# EAGLE design statim board2 (EAGLE 9.5.2)
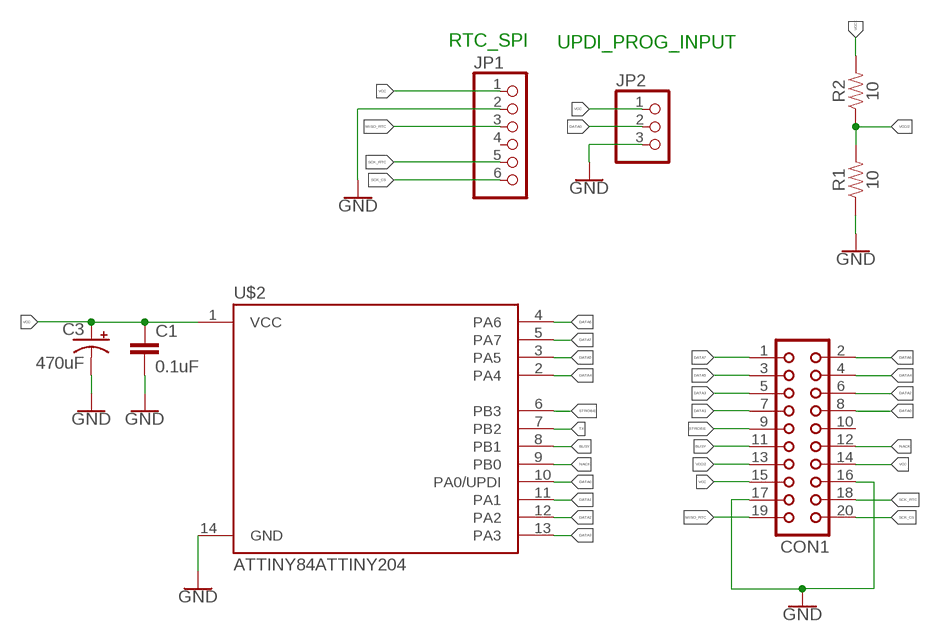
[diagram p0: schematic, sheet 1]

## Parts
C1  0.1uF  1.0UF-1206-50V-10%  [1206]
C3  470uF  560UF-PANASONIC_G-25V-20%  [PANASONIC_G]
CON1  CON20  [CON20]
JP1  PINHD-1X6  [1X06]
JP2  PINHD-1X3  [1X03]
R1  10  10OHM-1206-1/4W-1%  [1206]
R2  10  10OHM-1206-1/4W-1%  [1206]
U$2  ATTINY84ATTINY204  [SO14]

## Nets
BUSY: CON1.11 U$2.8(PB1)
DATA0: CON1.8 JP2.2 U$2.10(PA0/UPDI)
DATA1: CON1.7 U$2.11(PA1)
DATA2: CON1.6 U$2.12(PA2)
DATA3: CON1.5 U$2.13(PA3)
DATA4: CON1.4 U$2.2(PA4)
DATA5: CON1.3 U$2.3(PA5)
DATA6: CON1.2 U$2.4(PA6)
DATA7: CON1.1 U$2.5(PA7)
GND: C1.2 C3.- CON1.16 CON1.17 JP1.2 JP2.3 R1.1 U$2.14(GND)
MISO_RTC: CON1.19 JP1.3
NACK: CON1.12 U$2.9(PB0)
SCK_CS: CON1.20 JP1.6
SCK_RTC: CON1.18 JP1.5
STROBE: CON1.9 U$2.6(PB3)
TX: U$2.7(PB2)
VCC: C1.1 C3.+ CON1.14 CON1.15 JP1.1 JP2.1 R2.2 U$2.1(VCC)
VCC/2: CON1.13 R1.2 R2.1
Unconnected: CON1.10 JP1.4

## Notes on the sheet
- RTC_SPI | UPDI_PROG_INPUT

## Library data of the parts
C1 = SparkFun-Capacitors:1.0UF: 1µF ceramic capacitors A capacitor is a passive two-terminal electrical component used to store electrical energy temporarily in an electric field.; PROD_ID: CAP-09822; VALUE: 1.0uF
C3 = SparkFun-Capacitors:560UF: 560µF polarized capacitors A capacitor is a passive two-terminal electrical component used to store electrical energy temporarily in an electric field.; PROD_ID: CAP-09983; VALUE: 560uF
CON1 = con-harting:CON20: CONNECTOR; OC_FARNELL: unknown; OC_NEWARK: unknown
JP1 = adafruit:PINHD-1X6: PIN HEADER
JP2 = adafruit:PINHD-1X3: PIN HEADER
R1 R2 = SparkFun-Resistors:10OHM: 10Ω resistor A resistor is a passive two-terminal electrical component that implements electrical resistance as a circuit element. Resistors act to reduce current flow, and, at the same time, act to lower voltage levels within circuits. - Wikipedia; PROD_ID: RES-08705
U$2 = ATTINY204:ATTINY84: Atmel 14-pin 2/4/8kB flash uC Datasheet <https://cdn.sparkfun.com/datasheets/Widgets/doc8006.pdf> SparkFun Products Tiny AVR Programmer <https://www.sparkfun.com/products/11801> (PGM-11801) SparkFun Servo Trigger - Continuous Rotation <https://www.sparkfun.com/products/13872> (WIG-13872) SparkFun Servo Trigger <https://www.sparkfun.com/products/13118> (WIG-13118)

## Board
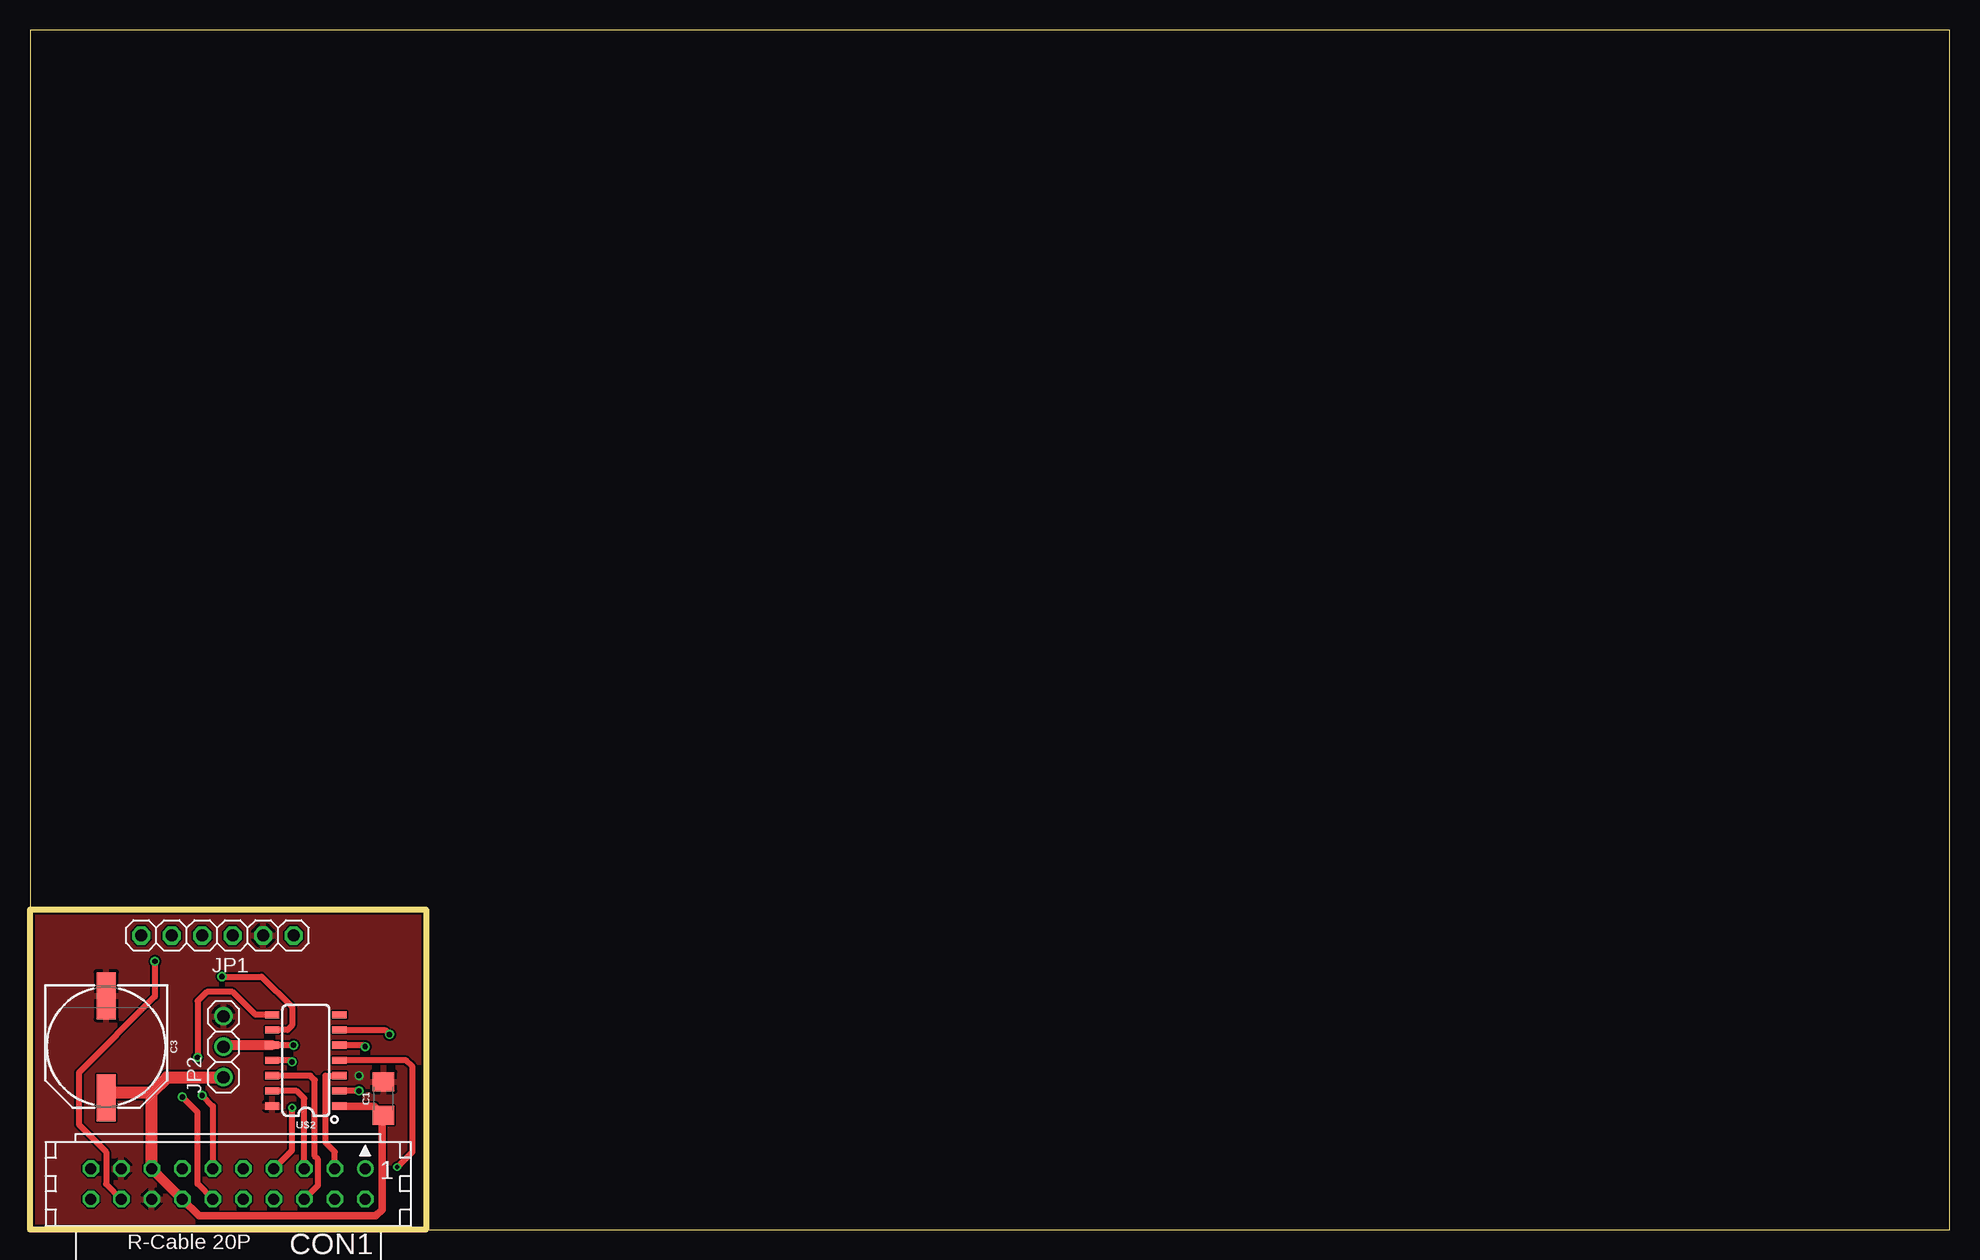
[diagram p1: board, top side]
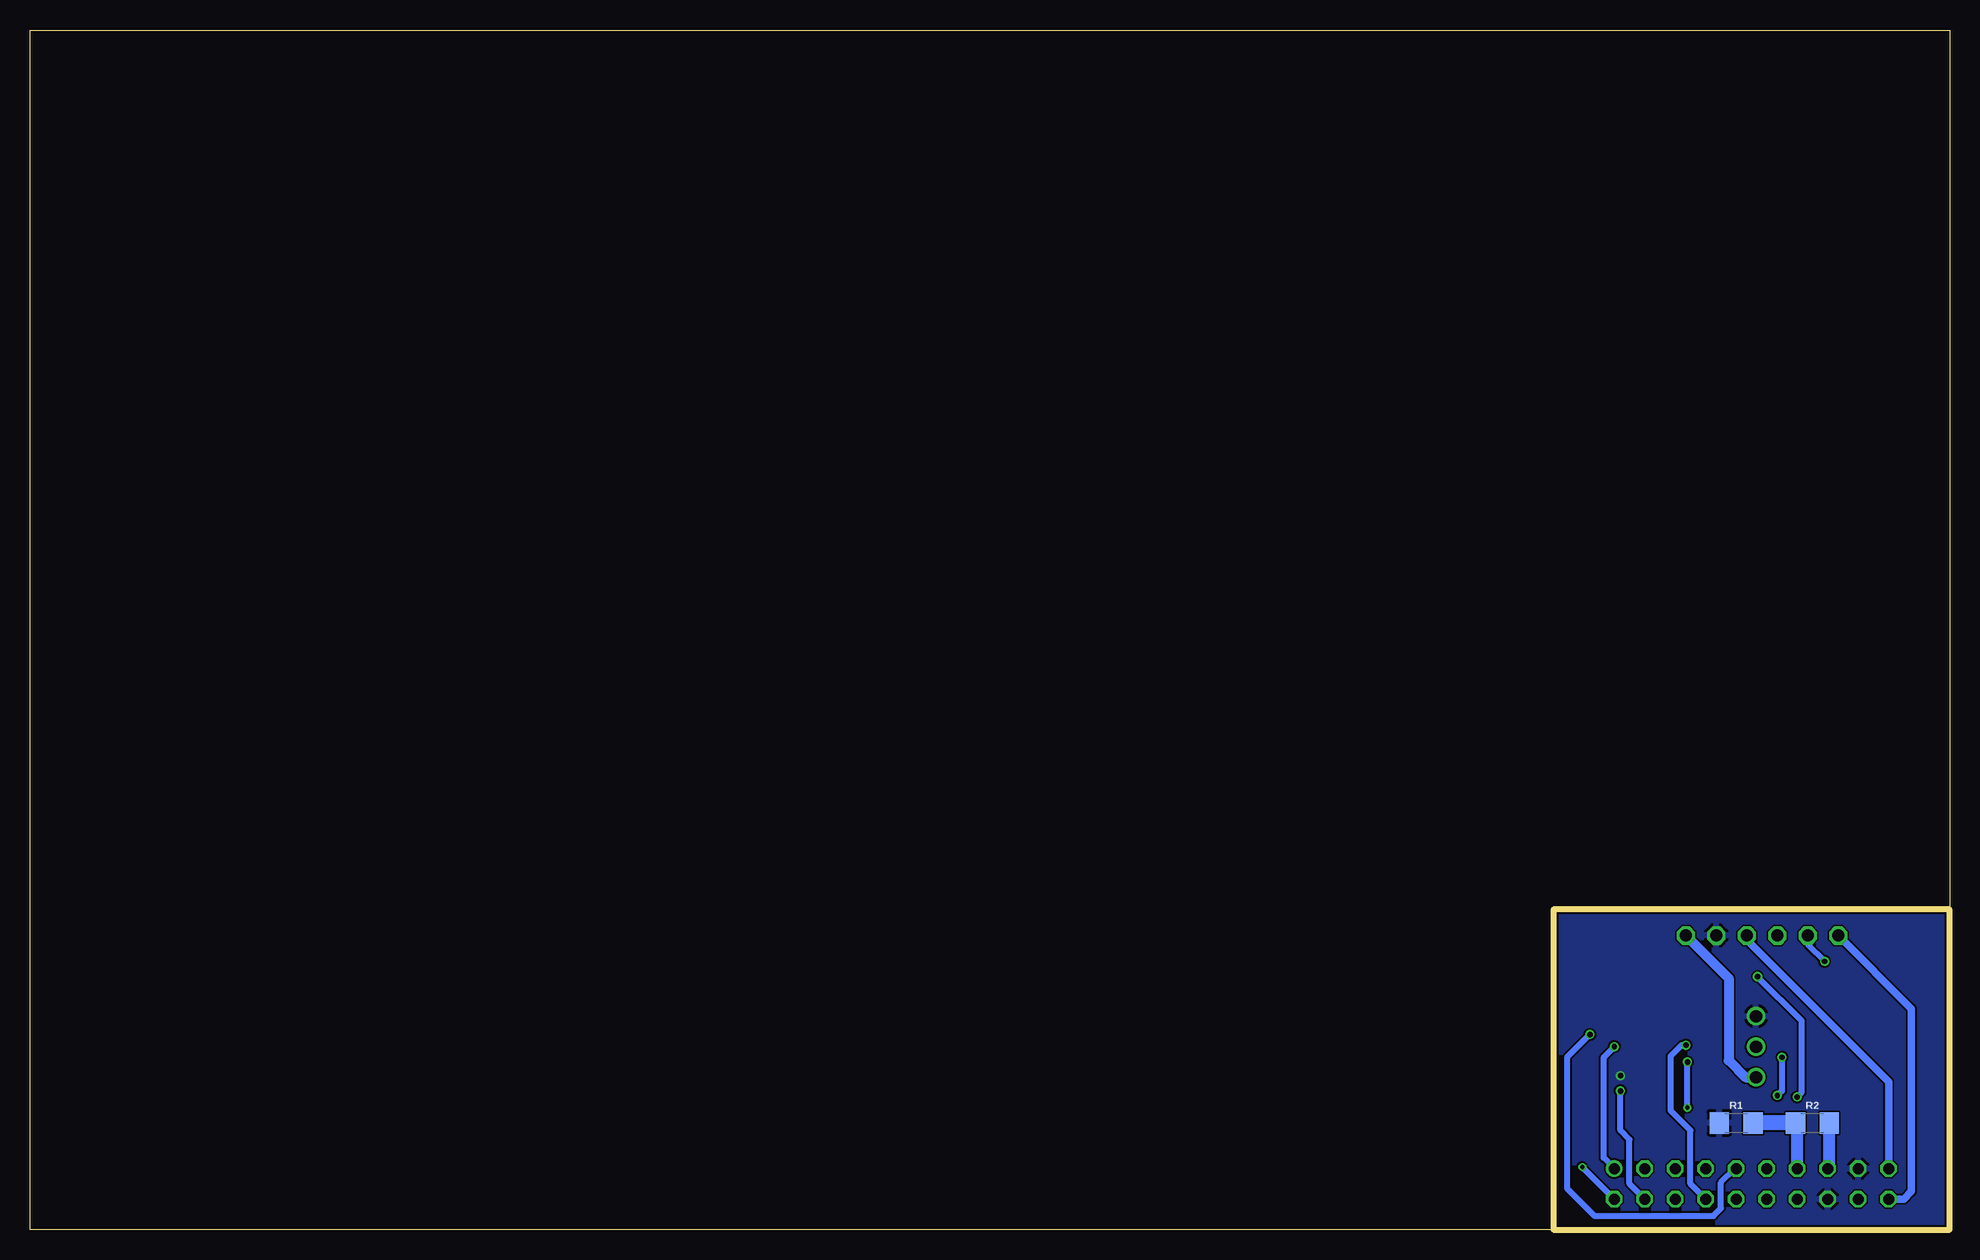
[diagram p2: board, bottom side, seen from below]

Size 160 x 100 mm. Coordinates in mm from the lower left corner, seen from the top.
Outline: 33.02,0 160,0 160,100 0,100 0,26.67
Outline: 0,26.67 0,0 33.02,0
Outline: 0,26.67 33.02,26.67 33.02,0
Copper layers (1*16): Top 0.035mm / dielectric 1.5mm / Bottom 0.035mm
Design rules "SparkFun-2-layer-PCBWay-LIMIT": minimum track width 6mil, minimum drill 0.3mm, track to track 6mil, track to pad 6mil, pad to pad 6mil, via to via 6mil, smd to smd 6mil, copper to edge 6mil, drill to drill 6mil, minimum pad ring 6mil, minimum via ring 6mil, stop-mask expansion 4mil, vias tented up to drill 25mil, thermal gap 10mil

### Footprints (pad centres in the part's own frame; a part is rotated, then mirrored left to right if it is on the bottom)
1206 = smd 1.6 x 1.8: 1 -1.4,0; 2 1.4,0
PANASONIC_G = smd 3.9 x 1.6: + 4.25,0; - -4.25,0
CON20 = drill 0.914: 1 -11.43,-1.27 | drill 0.914 octagon: 2 -11.43,1.27; 3 -8.89,-1.27; 4 -8.89,1.27; 5 -6.35,-1.27; 6 -6.35,1.27; 7 -3.81,-1.27; 8 -3.81,1.27; 9 -1.27,-1.27; 10 -1.27,1.27; 11 1.27,-1.27; 12 1.27,1.27; 13 3.81,-1.27; 14 3.81,1.27; 15 6.35,-1.27; 16 6.35,1.27; 17 8.89,-1.27; 18 8.89,1.27; 19 11.43,-1.27; 20 11.43,1.27
1X06 = drill 1.016 octagon: 1 -6.35,0; 2 -3.81,0; 3 -1.27,0; 4 1.27,0; 5 3.81,0; 6 6.35,0
1X03 = drill 1.016: 1 -2.54,0; 2 0,0; 3 2.54,0
SO14 = smd 0.6 x 1.2: 1 -3.175,-2.8; 2 -1.905,-2.8; 3 -0.635,-2.8; 4 0.635,-2.8; 5 1.905,-2.8; 6 3.175,-2.8; 7 4.445,-2.8; 8 4.445,2.8; 9 3.175,2.8; 10 1.905,2.8; 11 0.635,2.8; 12 -0.635,2.8; 13 -1.905,2.8; 14 -3.175,2.8

### Placement (x,y rotation side)
C1  29.46,10.92 90 top
C3  6.35,15.24 270 top
CON1  16.51,3.81 180 top
JP1  15.62,24.51 180 top
JP2  16.13,15.24 90 top
R1  17.78,8.89 0 bottom
R2  11.43,8.89 0 bottom
U$2  22.99,13.46 90 top

### Tracks (layer width: path | path; a pad name or v marks a point on that pad's centre or on a via)
BUSY  (via drill 0.45)
  Top 0.508: v13.97,14.35 13.97,19.05 14.73,19.81 16.89,19.81 18.8,17.91 U$2.8 | v14.35,11.18 15.24,10.29 CON1.11
  Bottom 0.508: v13.97,14.35 13.97,11.56 v14.35,11.18
DATA0  (via drill 0.45)
  Top 0.508: v21.97,15.37 U$2.10
  Top 0.813: U$2.10 16.26,15.37 JP2.2
  Bottom 0.508: CON1.8 21.59,3.81 21.59,8.26 23.24,9.91 23.24,14.48 22.35,15.37 v21.97,15.37
DATA1  (via drill 0.35, 0.45)
  Top 0.508: v21.84,13.97 21.72,14.1 U$2.11 | CON1.7 21.84,6.6 v21.84,10.16
  Bottom 0.508: v21.84,10.16 v21.84,13.97
DATA2
  Top 0.508: CON1.6 24,3.68 24,5.84 23.75,6.1 23.75,12.45 23.37,12.83 U$2.12
DATA3
  Top 0.508: U$2.13 22.23,11.56 22.86,10.92 CON1.5
DATA4  (via drill 0.45)
  Top 0.508: v27.43,11.56 U$2.2
  Bottom 0.508: CON1.4 26.67,3.81 26.67,7.49 27.43,8.26 v27.43,11.56
DATA5
  Top 0.508: CON1.3 25.4,6.48 24.64,7.24 24.64,12.83 U$2.3
DATA6  (via drill 0.35)
  Top 0.508: U$2.4 31.37,14.1 31.88,13.59 31.88,7.11 31.88,6.48 v30.61,5.21
  Bottom 0.508: CON1.2 v30.61,5.21
DATA7  (via drill 0.45)
  Top 0.508: v27.94,15.24 27.81,15.37 U$2.5
  Bottom 0.508: CON1.1 28.83,5.97 28.83,14.35 v27.94,15.24
GND  (via drill 0.45)
  other vias: 27.43,12.83
  pour Top: 0,0 0,26.67 33.02,26.67 33.02,0
  pour Bottom: 0,0 0,26.67 33.02,26.67 33.02,0
MISO_RTC
  Bottom 0.61: CON1.19 5.08,12.32 16.89,24.13 JP1.3
NACK  (via drill 0.45)
  Top 0.508: CON1.12 13.97,3.81 13.97,9.78 v12.7,11.05 | v16,21.08 19.3,21.08 21.84,18.54 21.84,17.02 21.46,16.64 U$2.9
  Bottom 0.508: v12.7,11.05 12.32,11.43 12.32,17.4 v16,21.08
SCK_CS
  Bottom 0.61: JP1.6 3.17,18.41 3.17,3.17 3.81,2.54 CON1.20
SCK_RTC  (via drill 0.45)
  Top 0.508: v10.41,22.35 10.41,19.43 4.06,13.08 4.06,8.76 6.35,6.48 6.35,3.81 CON1.18
  Bottom 0.508: JP1.5 11.81,23.75 v10.41,22.35
STROBE  (via drill 0.45)
  Top 0.508: U$2.6 29.59,16.64 v29.97,16.26
  Bottom 0.508: v29.97,16.26 31.88,14.35 31.88,3.43 29.59,1.14 19.68,1.14 19.05,1.78 19.05,3.94 17.91,5.08 CON1.9
VCC
  Top 0.305: 29.34,9.39 C1.1
  Top 0.61: U$2.1 28.7,10.29 C1.1 | CON1.14 14.1,1.14 28.83,1.14 29.34,1.65 29.34,9.39
  Top 0.813: CON1.14 CON1.15
  Top 1.016: CON1.15 10.16,11.43 | 10.16,11.43 11.43,12.7 JP2.1 | C3.+ 6.79,11.43 10.16,11.43
  Bottom 0.305: CON1.15 10.03,5.21
  Bottom 0.813: JP1.1 18.41,20.95 18.41,14.1 17.02,12.7 JP2.1
  Bottom 1.016: 10.03,5.21 R2.2
VCC/2
  Bottom 0.305: 12.7,8.76 R2.1
  Bottom 1.016: CON1.13 12.7,8.76
  Bottom 1.27: R2.1 R1.2